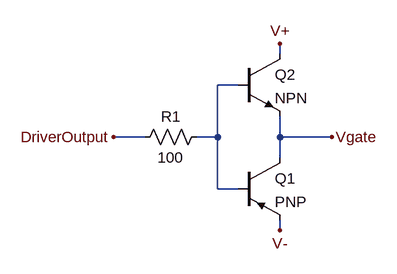
[diagram p0: schematic Draft1.asc]
Draft1.asc, the LTspice schematic file:
Version 4
SHEET 1 880 680
WIRE 288 -16 288 -32
WIRE 224 32 192 32
WIRE 80 112 32 112
WIRE 192 112 192 32
WIRE 192 112 160 112
WIRE 288 112 288 80
WIRE 368 112 288 112
WIRE 288 144 288 112
WIRE 192 192 192 112
WIRE 224 192 192 192
WIRE 288 256 288 240
FLAG 288 -32 V+
FLAG 288 256 V-
FLAG 32 112 DriverOutput
FLAG 368 112 Vgate
SYMBOL pnp 224 144 R0
SYMATTR InstName Q1
SYMBOL npn 224 -16 R0
SYMATTR InstName Q2
SYMBOL res 176 96 R90
WINDOW 0 0 56 VBottom 2
WINDOW 3 32 56 VTop 2
SYMATTR InstName R1
SYMATTR Value 100

The netlist it stands for:
* Draft1.asc
Q1 Vgate N001 V- 0 PNP
Q2 V+ N001 Vgate 0 NPN
R1 N001 DriverOutput 100
.model NPN NPN
.model PNP PNP
.lib standard.bjt
.backanno
.end